# EAGLE design entropy_king (EAGLE 5.06)

## Sheet 1 of 2
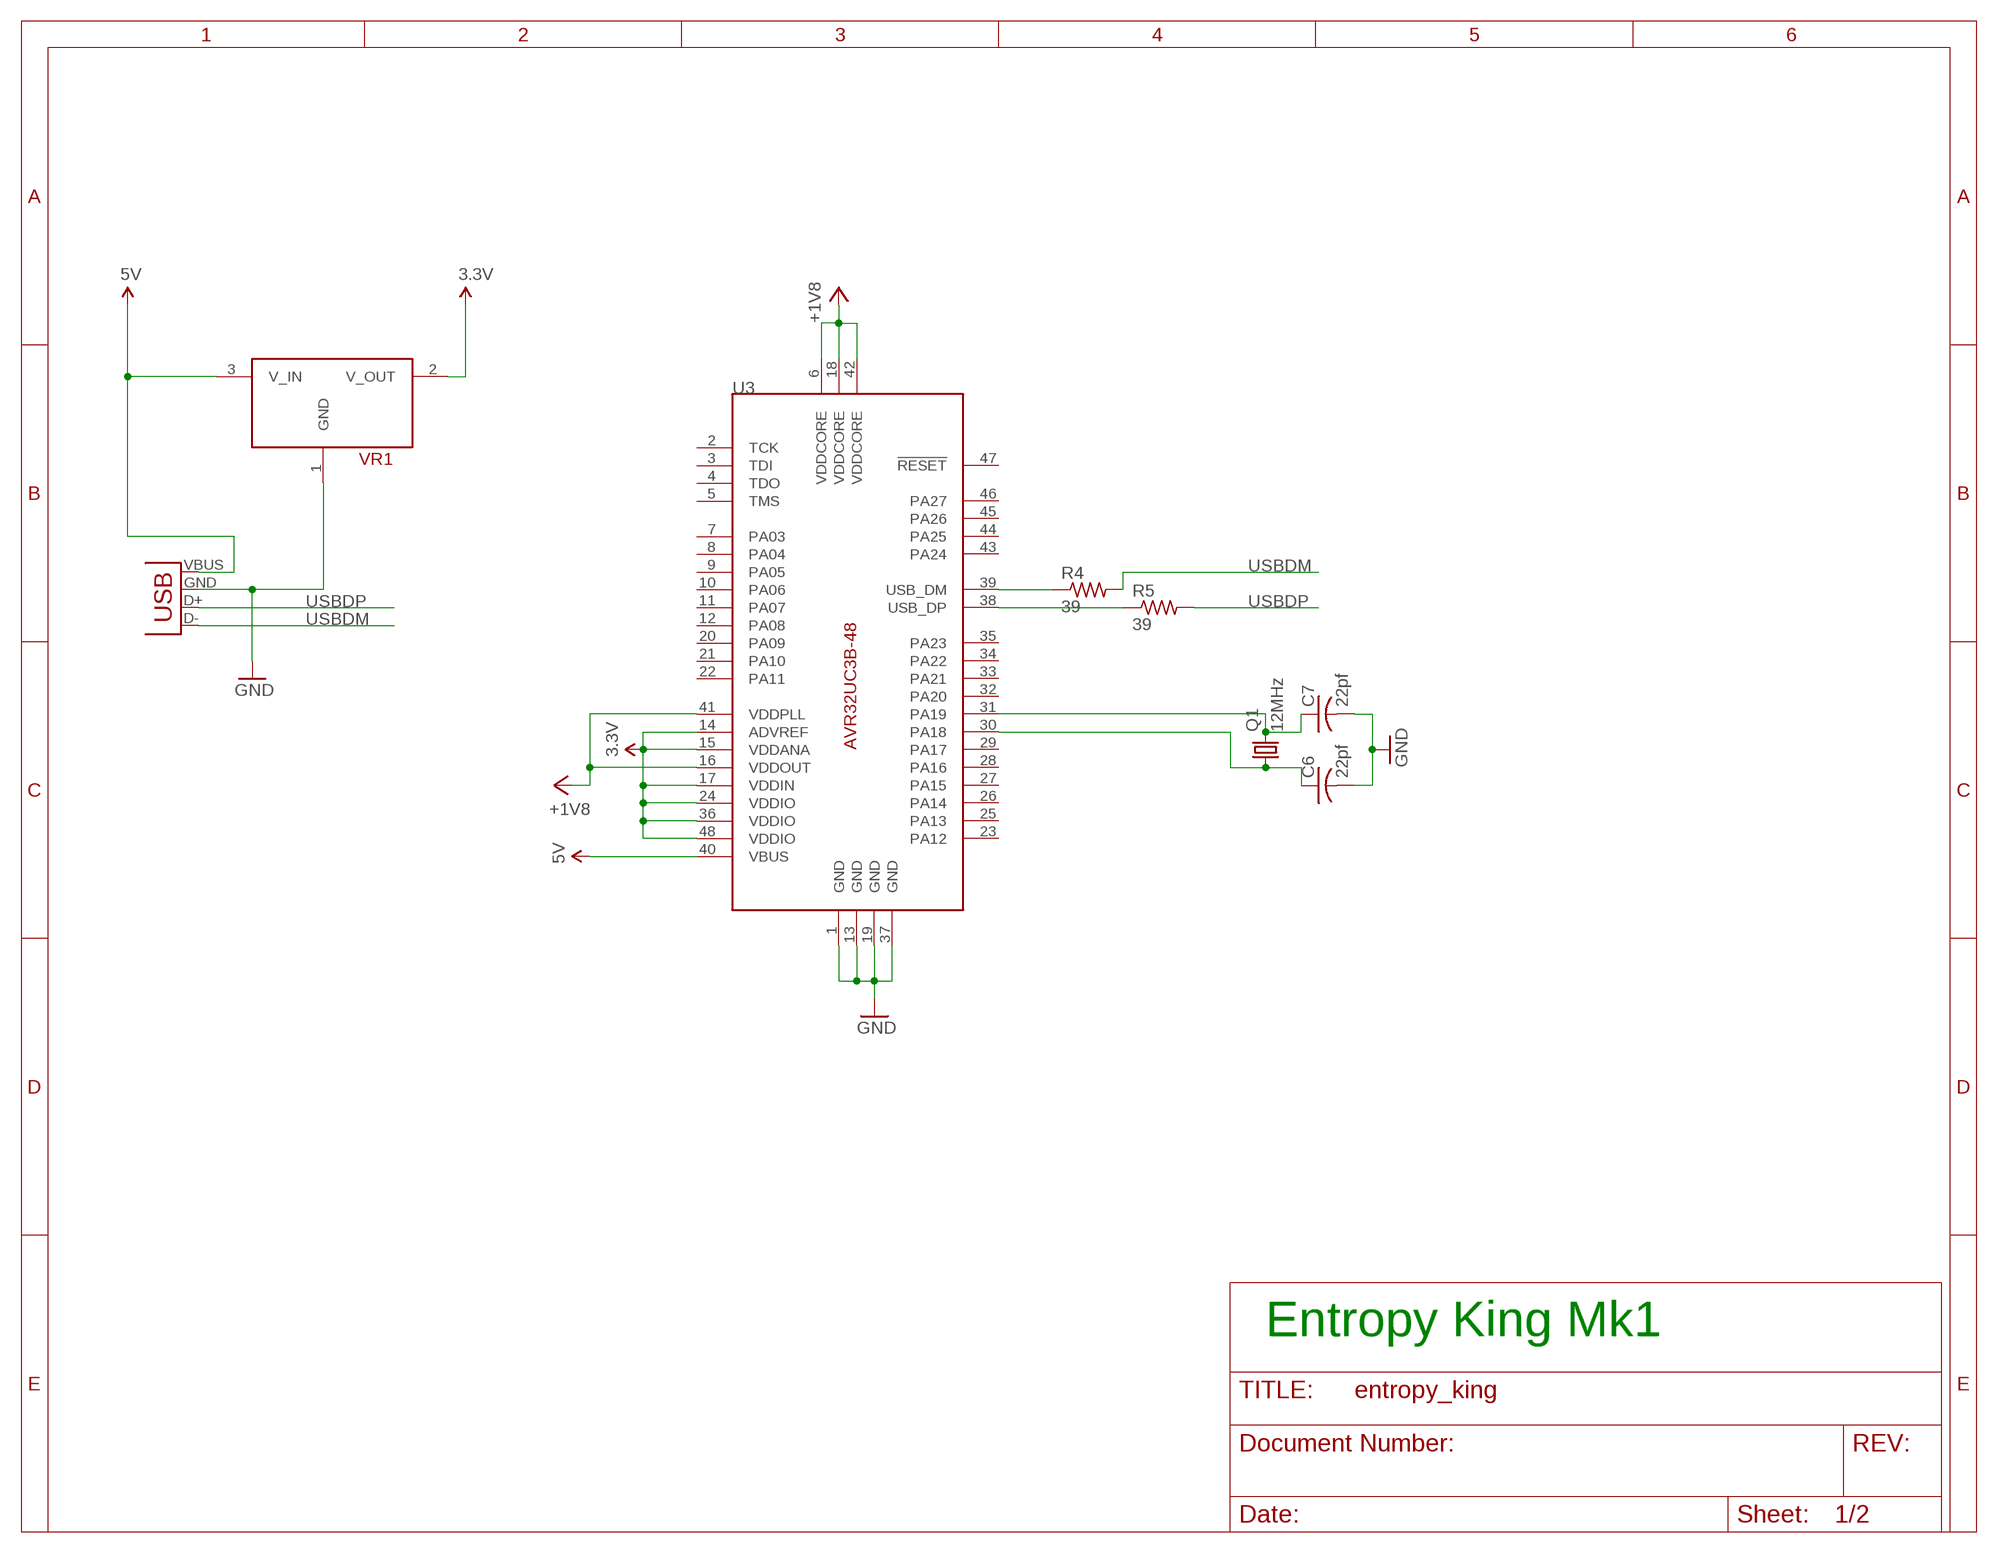
[diagram p0: schematic, sheet 1]

### Parts
C6  22pf  C-USC0603  [C0603]
C7  22pf  C-USC0603  [C0603]
Q1  12MHz  CRYSTAL25X3.2  [CRYSTAL-SMD-5X3.2]
R4  39  R-US_R0603  [R0603]
R5  39  R-US_R0603  [R0603]
U3  AVR32UC3B-48TQFP  [TQFP48]
VR1  MCP1700  [SOT23]
X1  USB-A-H  [USB-A-H]

### Nets
3.3V: U3.14(ADVREF) U3.15(VDDANA) U3.17(VDDIN) U3.24(VDDIO) U3.36(VDDIO) U3.48(VDDIO) VR1.2(V_OUT)
5V: U3.40(VBUS) VR1.3(V_IN) X1.VBUS(GND)
+1V8: U3.6(VDDCORE) U3.16(VDDOUT) U3.18(VDDCORE) U3.41(VDDPLL) U3.42(VDDCORE)
GND: C6.2 C7.2 U3.1(GND) U3.13(GND) U3.19(GND) U3.37(GND) VR1.1(GND) X1.GND(VBUS) ; also sheet 2
N$6: R4.1 U3.39(USB_DM)
N$11: R5.1 U3.38(USB_DP)
USBDM: R4.2 X1.D-(D+)
USBDP: R5.2 X1.D+(D-)
XIN: C6.1 Q1.1 U3.30(PA18)
XOUT: C7.1 Q1.3 U3.31(PA19)
Unconnected: U3.2(TCK) U3.3(TDI) U3.4(TDO) U3.5(TMS) U3.7(PA03) U3.8(PA04) U3.9(PA05) U3.10(PA06) U3.11(PA07) U3.12(PA08) U3.20(PA09) U3.21(PA10) U3.22(PA11) U3.23(PA12) U3.25(PA13) U3.26(PA14) U3.27(PA15) U3.28(PA16) U3.29(PA17) U3.32(PA20) U3.33(PA21) U3.34(PA22) U3.35(PA23) U3.43(PA24) U3.44(PA25) U3.45(PA26) U3.46(PA27) U3.47(!RESET)

### Notes on the sheet
- Entropy King Mk1

## Sheet 2 of 2
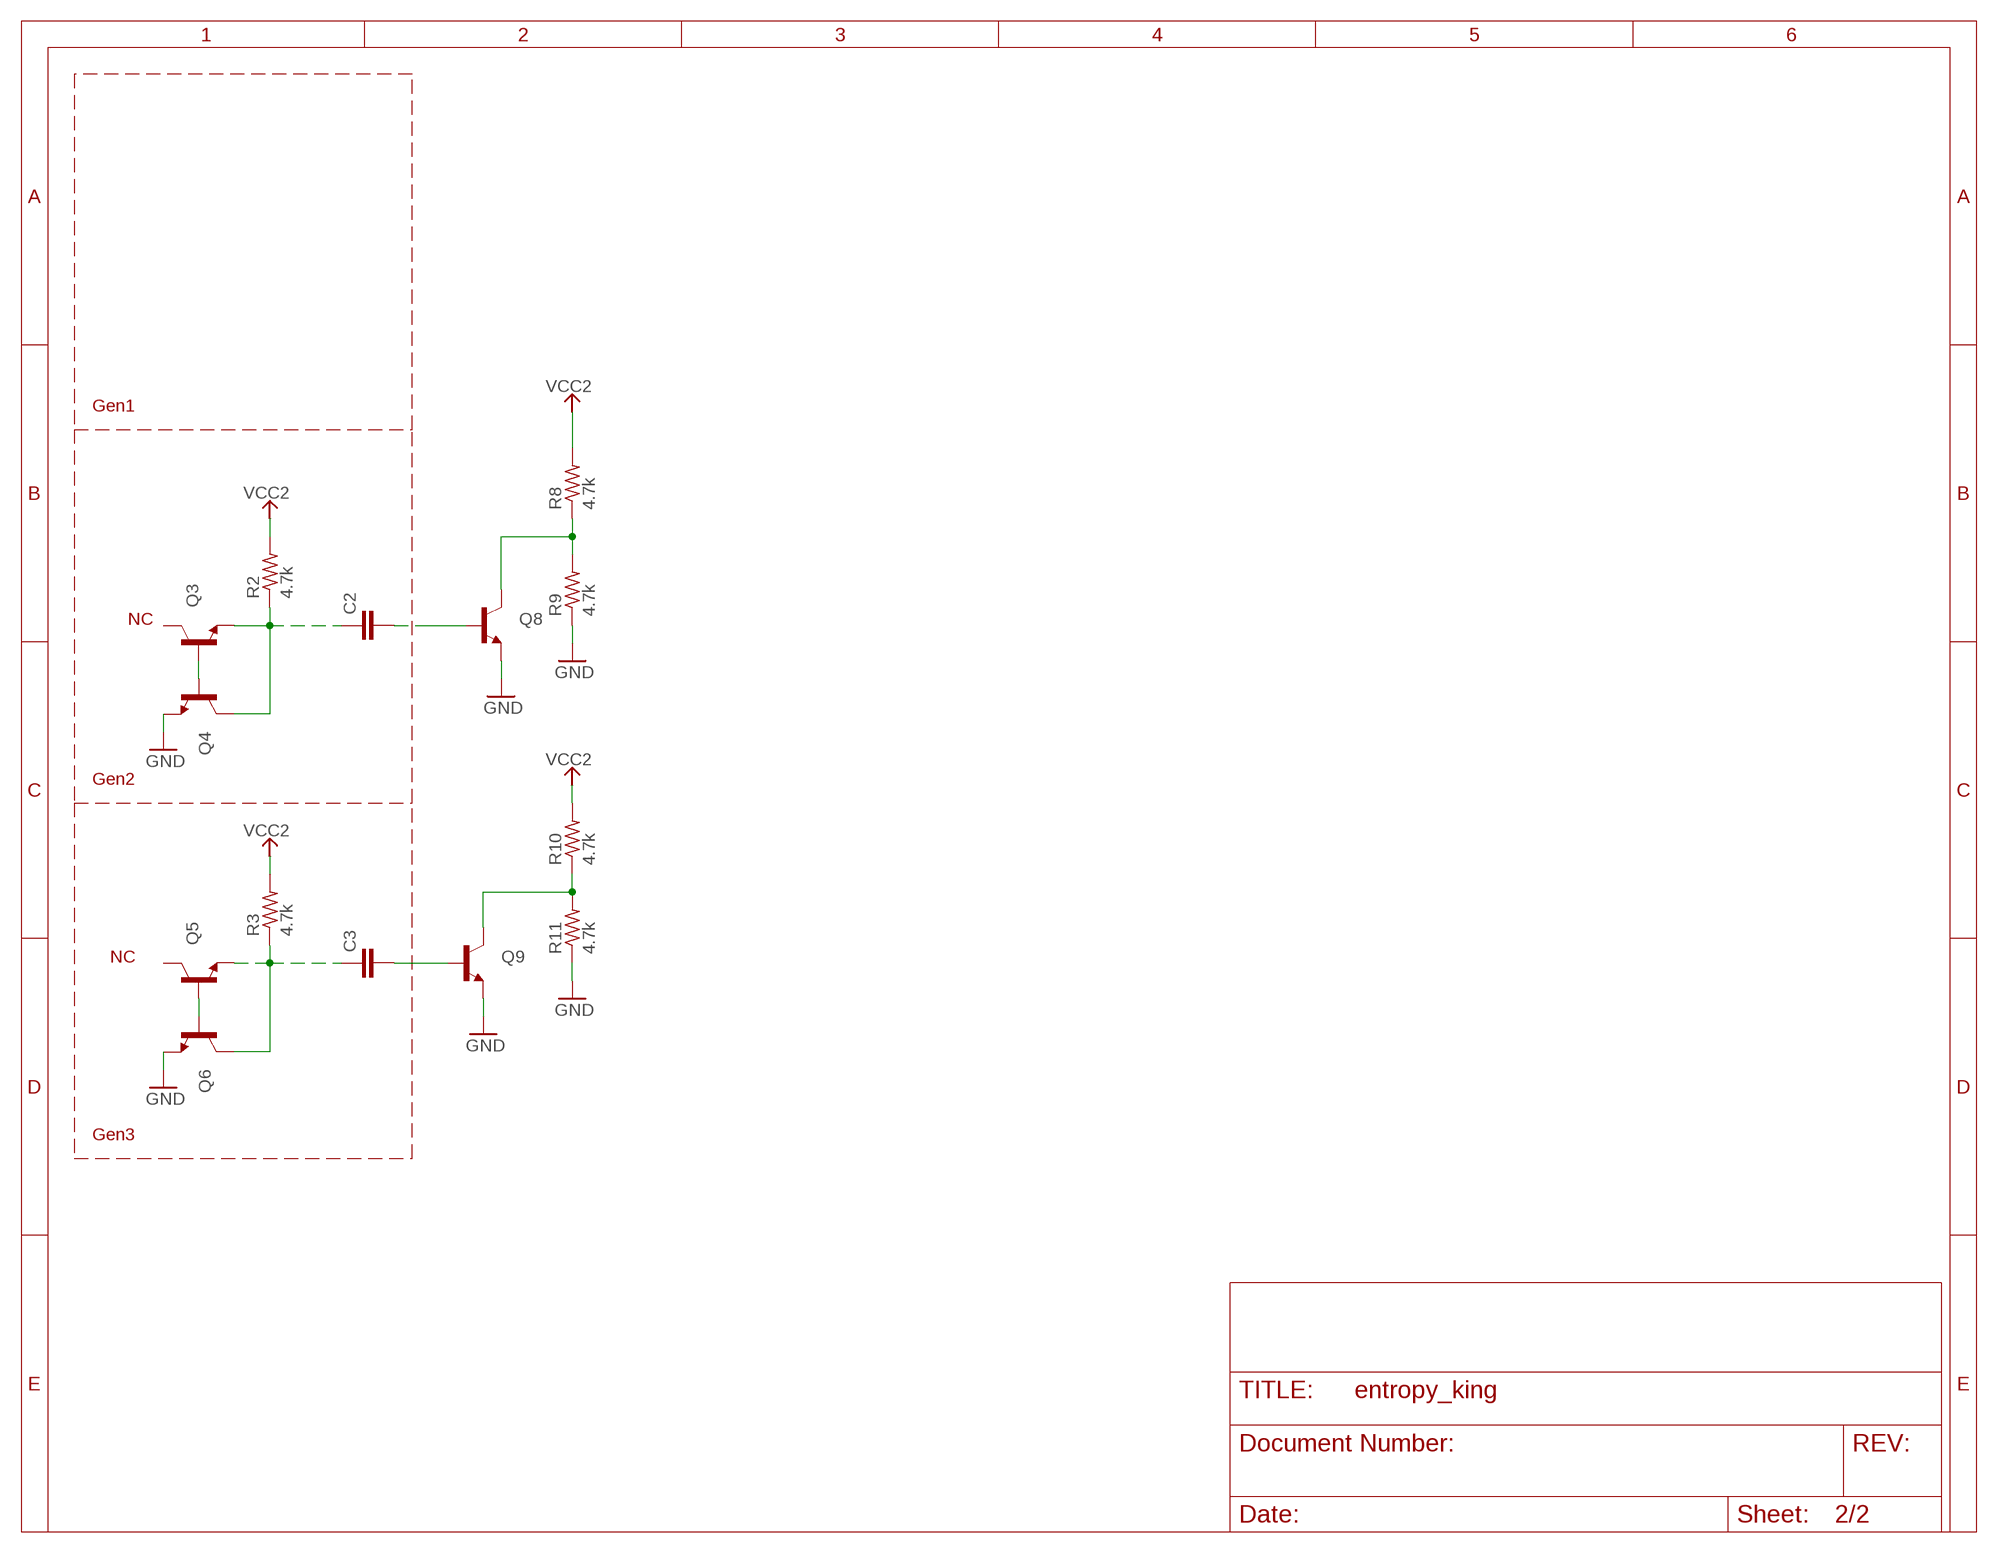
[diagram p1: schematic, sheet 2]

### Parts
C2  C-EUC0603  [C0603]
C3  C-EUC0603  [C0603]
Q3  TRANSISTOR_NPNSOT23-3  [SOT23-3]
Q4  TRANSISTOR_NPNSOT23-3  [SOT23-3]
Q5  TRANSISTOR_NPNSOT23-3  [SOT23-3]
Q6  TRANSISTOR_NPNSOT23-3  [SOT23-3]
Q8  TRANSISTOR_NPNSOT23-3  [SOT23-3]
Q9  TRANSISTOR_NPNSOT23-3  [SOT23-3]
R2  4.7k  R-US_R0402  [R0402]
R3  4.7k  R-US_R0402  [R0402]
R8  4.7k  R-US_R0402  [R0402]
R9  4.7k  R-US_R0402  [R0402]
R10  4.7k  R-US_R0402  [R0402]
R11  4.7k  R-US_R0402  [R0402]

### Nets
GND: Q4.2(E) Q6.2(E) Q8.2(E) Q9.2(E) R9.1 R11.1 ; also sheet 1
N$1: C2.2 Q8.1(B)
N$3: C3.2 Q9.1(B)
N$7: C2.1 Q3.2(E) Q4.3(C) R2.1
N$8: Q3.1(B) Q4.1(B)
N$9: Q5.1(B) Q6.1(B)
N$10: C3.1 Q5.2(E) Q6.3(C) R3.1
N$13: Q8.3(C) R8.1 R9.2
N$14: Q9.3(C) R10.1 R11.2
VCC2: R2.2 R3.2 R8.2 R10.2
Unconnected: Q3.3(C) Q5.3(C)

### Notes on the sheet
- Gen1
- NC
- Gen2
- NC
- Gen3

## Library data of the parts
C2 C3 = rcl:C-EU: CAPACITOR, European symbol
C6 C7 = rcl:C-US: CAPACITOR, American symbol
Q1 = xtal:CRYSTAL2: Crystals
Q3-Q6 Q8 Q9 = StackFoundry:TRANSISTOR_NPN: Transistor NPN BJT configuration in SOT23 package. MMBT2222 is the common NPN we use. Double check BCE configuration again layout.
R2-R5 R8-R11 = rcl:R-US_: RESISTOR, American symbol
U3 = atmel:AVR32UC3B-48: AVR32 UC3B1xxx series microcontroller This is the 48 pin version of the UC3B microcontroller.
VR1 = microchip:MCP1700
X1 = StackFoundry:USB: USB Connectors USB-B-PTH is fully proven USB-A-PCB is untested. USB-A-H is throughly reviewed, but untested. USB-B-SMT is throughly reviewed, but untested. USB-A-S has not been used/tested USB-MB-H has not been used/tested

## Board
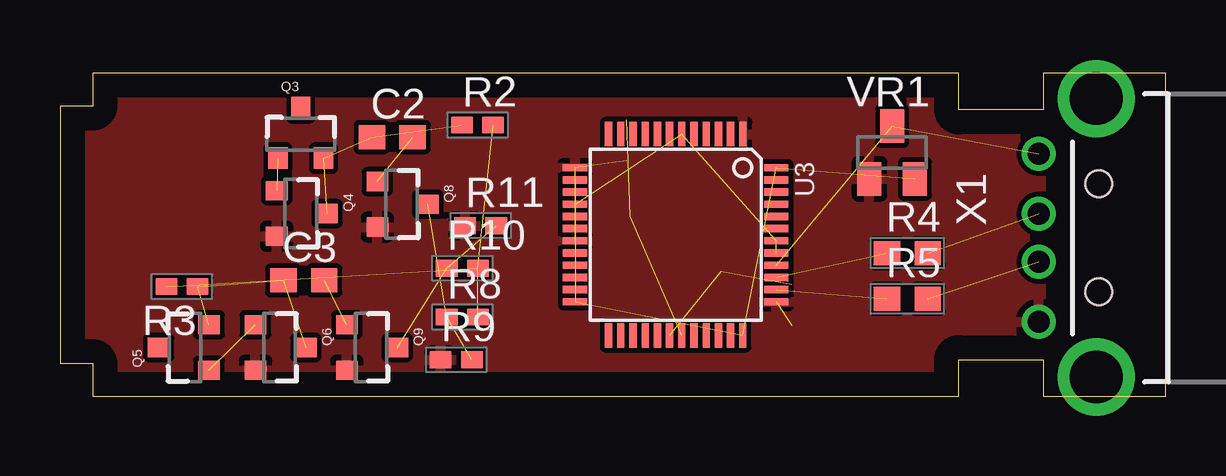
[diagram p2: board, top side]
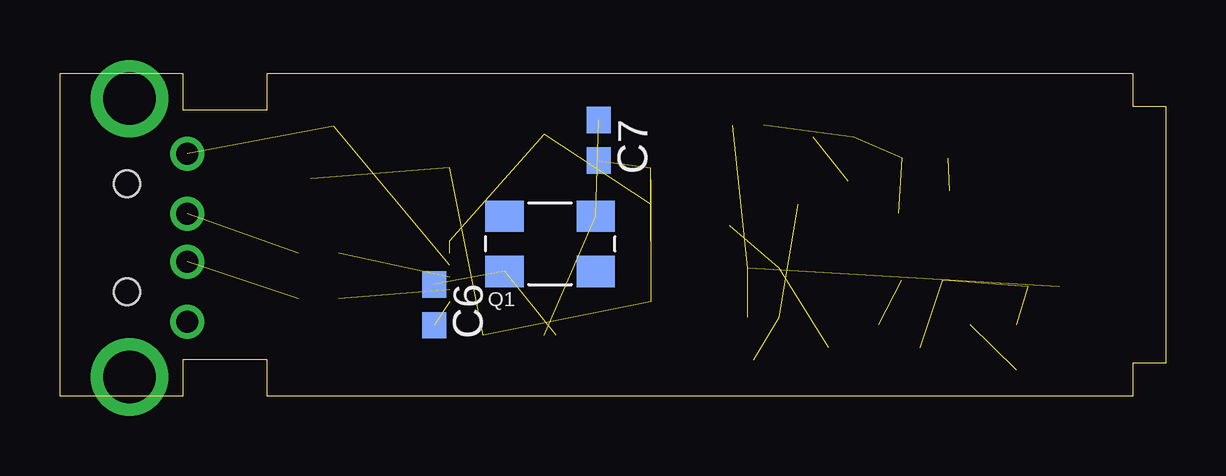
[diagram p3: board, bottom side, seen from below]

Size 46.08 x 13.46 mm. Coordinates in mm from the lower left corner, seen from the top.
Outline: 1.37,1.37 1.37,0 37.44,0 37.44,1.52 40.97,1.52 40.97,0 46.08,0 46.08,13.46 40.97,13.46 40.97,11.94 37.44,11.94 37.44,13.46 1.37,13.46 1.37,12.09 0,12.09 0,1.37 1.37,1.37
Copper layers (1*16): Top 0.035mm / dielectric 1.5mm / Bottom 0.035mm
Design rules "default": minimum track width 10mil, minimum drill 24mil, track to track 8mil, track to pad 8mil, pad to pad 8mil, via to via 8mil, smd to smd 8mil, copper to edge 40mil, drill to drill 8mil, minimum pad ring 10mil, minimum via ring 8mil, stop-mask expansion 4mil, vias tented up to drill 0mil, thermal gap 10mil

### Footprints (pad centres in the part's own frame; a part is rotated, then mirrored left to right if it is on the bottom)
C0603 = smd 1.1 x 1: 1 -0.85,0; 2 0.85,0
CRYSTAL-SMD-5X3.2 = smd 1.6 x 1.3: 1 -1.9,-1.15; 2 1.9,-1.15; 3 1.9,1.15; 4 -1.9,1.15
SOT23-3 = smd 0.8 x 0.9: 1 -0.95,-1; 2 0.95,-1; 3 0,1.1
R0402 = smd 0.9 x 0.7: 1 -0.65,0; 2 0.65,0
R0603 = smd 1.1 x 1: 1 -0.85,0; 2 0.85,0
TQFP48 = smd 1.016 x 0.305: 1 -4.191,2.794; 2 -4.191,2.286; 3 -4.191,1.778; 4 -4.191,1.27; 5 -4.191,0.762; 6 -4.191,0.254; 7 -4.191,-0.254; 8 -4.191,-0.762; 9 -4.191,-1.27; 10 -4.191,-1.778; 11 -4.191,-2.286; 12 -4.191,-2.794; 25 4.191,-2.794; 26 4.191,-2.286; 27 4.191,-1.778; 28 4.191,-1.27; 29 4.191,-0.762; 30 4.191,-0.254; 31 4.191,0.254; 32 4.191,0.762; 33 4.191,1.27; 34 4.191,1.778; 35 4.191,2.286; 36 4.191,2.794 | smd 0.305 x 1.016: 13 -2.794,-4.191; 14 -2.286,-4.191; 15 -1.778,-4.191; 16 -1.27,-4.191; 17 -0.762,-4.191; 18 -0.254,-4.191; 19 0.254,-4.191; 20 0.762,-4.191; 21 1.27,-4.191; 22 1.778,-4.191; 23 2.286,-4.191; 24 2.794,-4.191; 37 2.794,4.191; 38 2.286,4.191; 39 1.778,4.191; 40 1.27,4.191; 41 0.762,4.191; 42 0.254,4.191; 43 -0.254,4.191; 44 -0.762,4.191; 45 -1.27,4.191; 46 -1.778,4.191; 47 -2.286,4.191; 48 -2.794,4.191
SOT23 = smd 1 x 1.4: 1 -0.95,-1.1; 2 0.95,-1.1; 3 0,1.1
USB-A-H = drill 0.914 round: D+ 2.4,1; D- 2.4,-1; GND 2.4,3.5; VBUS 2.4,-3.5 | drill 2.2 round: GND@1 0,5.8; GND@2 0,-5.8 | hole 1.1: -0.1,2.25; -0.1,-2.25

### Placement (x,y rotation side)
C2  13.84,10.79 0 top
C3  10.16,4.83 0 top
C6  30.48,3.81 270 bottom
C7  23.62,10.67 270 bottom
Q1  25.65,6.35 0 bottom
Q3  10.03,10.92 0 top
Q4  10.03,7.62 270 top
Q5  5.21,2.03 90 top
Q6  9.14,2.03 270 top
Q8  14.22,8 270 top
Q9  12.95,2.03 270 top
R2  17.4,11.3 0 top
R3  5.08,4.57 180 top
R4  35.31,5.97 0 top
R5  35.31,4.06 0 top
R8  16.76,3.3 0 top
R9  16.51,1.52 0 top
R10  16.76,5.33 0 top
R11  17.53,7.11 0 top
U3  25.65,6.73 270 top
VR1  34.67,10.16 0 top
X1  43.18,6.6 180 top

### Tracks (layer width: path | path; a pad name or v marks a point on that pad's centre or on a via)
3.3V  (6 unrouted)
5V  (2 unrouted)
+1V8  (4 unrouted)
GND  (3 unrouted)
  pour Top: -0.76,13.72 -0.76,-0.25 40.89,-0.25 40.89,13.46 0.25,13.46 0.25,13.72
N$1  (1 unrouted)
N$3  (1 unrouted)
N$6  (1 unrouted)
N$7  (3 unrouted)
N$8  (1 unrouted)
N$9  (1 unrouted)
N$10  (3 unrouted)
N$11  (1 unrouted)
N$13  (2 unrouted)
N$14  (2 unrouted)
USBDM  (1 unrouted)
USBDP  (1 unrouted)
VCC2  (3 unrouted)
XIN  (2 unrouted)
XOUT  (2 unrouted)